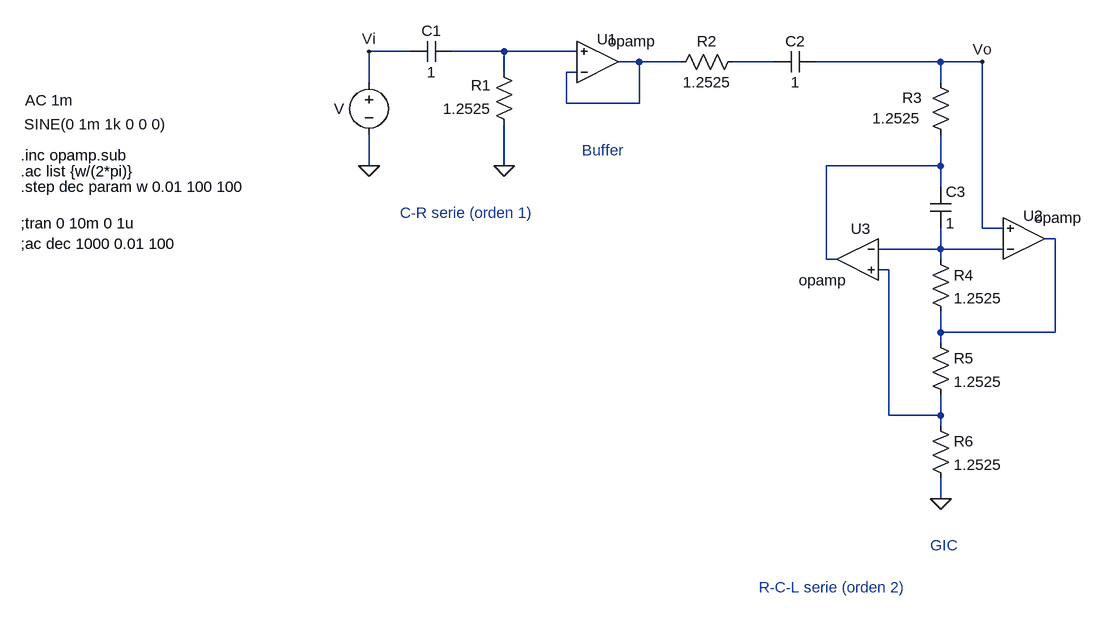
[diagram p0: schematic TS4_gic.asc]
TS4_gic.asc, the LTspice schematic file:
Version 4
SHEET 1 1700 1008
WIRE 48 160 -16 160
WIRE 192 160 112 160
WIRE 304 160 192 160
WIRE 400 176 368 176
WIRE 464 176 400 176
WIRE 608 176 544 176
WIRE 864 176 672 176
WIRE 928 176 864 176
WIRE 192 192 192 160
WIRE 304 192 288 192
WIRE -16 208 -16 160
WIRE 864 208 864 176
WIRE 288 240 288 192
WIRE 400 240 400 176
WIRE 400 240 288 240
WIRE -16 336 -16 288
WIRE 192 336 192 272
WIRE 864 336 864 288
WIRE 864 336 688 336
WIRE 864 368 864 336
WIRE 928 432 928 176
WIRE 960 432 928 432
WIRE 1040 448 1024 448
WIRE 864 464 864 432
WIRE 864 464 768 464
WIRE 960 464 864 464
WIRE 688 480 688 336
WIRE 704 480 688 480
WIRE 864 480 864 464
WIRE 784 496 768 496
WIRE 864 592 864 560
WIRE 1040 592 1040 448
WIRE 1040 592 864 592
WIRE 864 608 864 592
WIRE 784 720 784 496
WIRE 864 720 864 688
WIRE 864 720 784 720
WIRE 864 736 864 720
WIRE 864 848 864 816
FLAG -16 160 Vi
FLAG 928 176 Vo
FLAG -16 336 0
FLAG 192 336 0
FLAG 864 848 0
SYMBOL voltage -16 192 R0
WINDOW 123 -529 43 Left 2
WINDOW 39 0 0 Left 2
WINDOW 0 -54 56 Left 2
WINDOW 3 -531 80 Left 2
SYMATTR Value2 AC 1m
SYMATTR InstName V
SYMATTR Value SINE(0 1m 1k 0 0 0)
SYMBOL res 208 288 R180
WINDOW 0 36 76 Left 2
WINDOW 3 36 40 Left 2
SYMATTR InstName R1
SYMATTR Value 1.2525
SYMBOL cap 48 176 R270
WINDOW 0 32 32 VTop 2
WINDOW 3 0 32 VBottom 2
SYMATTR InstName C1
SYMATTR Value 1
SYMBOL cap 608 192 R270
WINDOW 0 32 32 VTop 2
WINDOW 3 0 32 VBottom 2
SYMATTR InstName C2
SYMATTR Value 1
SYMBOL res 560 160 R90
WINDOW 0 0 56 VBottom 2
WINDOW 3 32 56 VTop 2
SYMATTR InstName R2
SYMATTR Value 1.2525
SYMBOL res 848 192 R0
WINDOW 0 -43 39 Left 2
WINDOW 3 -89 71 Left 2
SYMATTR InstName R3
SYMATTR Value 1.2525
SYMBOL res 848 464 R0
SYMATTR InstName R4
SYMATTR Value 1.2525
SYMBOL res 848 592 R0
SYMATTR InstName R5
SYMATTR Value 1.2525
SYMBOL res 848 720 R0
SYMATTR InstName R6
SYMATTR Value 1.2525
SYMBOL cap 848 368 R0
SYMATTR InstName C3
SYMATTR Value 1
SYMBOL Opamps\\opamp 992 512 M180
WINDOW 0 -1 99 Left 2
SYMATTR InstName U2
SYMBOL Opamps\\opamp 736 416 M0
WINDOW 0 -20 17 Left 2
SYMATTR InstName U3
SYMBOL Opamps\\opamp 336 240 M180
WINDOW 0 -1 99 Left 2
SYMATTR InstName U1
TEXT -552 424 Left 2 !;tran 0 10m 0 1u
TEXT -552 456 Left 2 !;ac dec 1000 0.01 100
TEXT -552 368 Left 2 !.step dec param w 0.01 100 100
TEXT -552 344 Left 2 !.ac list {w/(2*pi)}
TEXT -552 320 Left 2 !.inc opamp.sub
TEXT 32 408 Left 2 ;C-R serie (orden 1)
TEXT 584 984 Left 2 ;R-C-L serie (orden 2)
TEXT 848 920 Left 2 ;GIC
TEXT 312 312 Left 2 ;Buffer

The netlist it stands for:
* TS4_gic.asc
V Vi 0 SINE(0 1m 1k 0 0 0) AC 1m
R1 0 N001 1.2525
C1 Vi N001 1
C2 N003 Vo 1
R2 N003 N002 1.2525
R3 Vo N004 1.2525
R4 N006 N005 1.2525
R5 N005 N007 1.2525
R6 N007 0 1.2525
C3 N004 N006 1
XU2 N006 Vo N005 opamp Aol=100K GBW=10Meg  ; pins invin noninvin out
XU3 N006 N007 N004 opamp Aol=100K GBW=10Meg  ; pins invin noninvin out
XU1 N002 N001 N002 opamp Aol=100K GBW=10Meg  ; pins invin noninvin out
;tran 0 10m 0 1u
;ac dec 1000 0.01 100
.step dec param w 0.01 100 100
.ac list {w/(2*pi)}
.inc opamp.sub
* C-R serie (orden 1)
* R-C-L serie (orden 2)
* GIC
* Buffer
.backanno
.end